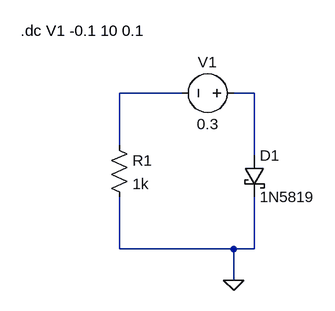
[diagram p0: schematic Draft1.asc]
Draft1.asc, the LTspice schematic file:
Version 4
SHEET 1 880 680
WIRE 128 -112 32 -112
WIRE 240 -112 208 -112
WIRE 32 -32 32 -112
WIRE 240 -16 240 -112
WIRE 32 128 32 48
WIRE 208 128 32 128
WIRE 240 128 240 48
WIRE 240 128 208 128
WIRE 208 176 208 128
FLAG 208 176 0
SYMBOL schottky 224 -16 R0
SYMATTR InstName D1
SYMATTR Value 1N5819
SYMBOL voltage 224 -112 R90
WINDOW 0 -32 56 VBottom 2
WINDOW 3 32 56 VTop 2
WINDOW 123 0 0 Left 0
WINDOW 39 0 0 Left 0
SYMATTR InstName V1
SYMATTR Value 0.3
SYMBOL res 16 -48 R0
SYMATTR InstName R1
SYMATTR Value 1k
TEXT -120 -208 Left 2 !.dc V1 -0.1 10 0.1

The netlist it stands for:
* Draft1.asc
D1 N002 0 1N5819
V1 N002 N001 0.3
R1 N001 0 1k
.model D D
.lib standard.dio
.dc V1 -0.1 10 0.1
.backanno
.end